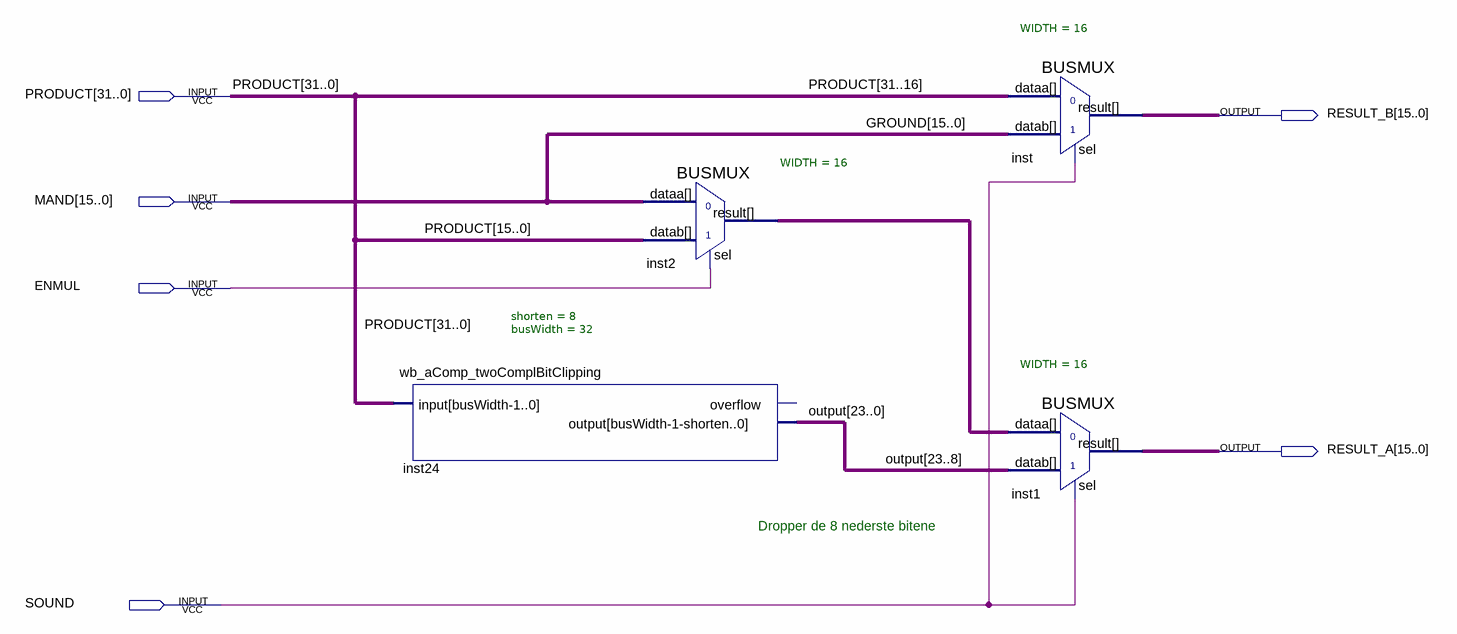
[diagram p0: schematic sheet]
// Quartus schematic wb_mul_outputselector.bdf as structural Verilog: 4 symbols, 6 pins
module wb_mul_outputselector (
  input  [31:0] PRODUCT,
  input  [15:0] MAND,
  input  ENMUL,
  input  SOUND,
  output [15:0] RESULT_B,
  output [15:0] RESULT_A
);

  wire [15:0] inst2_result;
  wire [23:0] \output ;

  wb_aComp_twoComplBitClipping #(.shorten(8), .busWidth(32)) inst24 (
    .\input (PRODUCT), .\output (\output ));  // open: overflow
  BUSMUX #(.WIDTH(16)) inst2 (.datab(PRODUCT[15:0]), .sel(ENMUL), .dataa(MAND), .result(inst2_result));
  BUSMUX #(.WIDTH(16)) inst (.datab(MAND), .sel(SOUND), .dataa(PRODUCT[31:16]), .result(RESULT_B));
  BUSMUX #(.WIDTH(16)) inst1 (.datab(\output [23:8]), .sel(SOUND), .dataa(inst2_result), .result(RESULT_A));

  // Other names for the same wires on the sheet: GROUND[15:0] = MAND

  // Notes on the sheet:
  //   Dropper de 8 nederste bitene
endmodule
